# Altium schematic sheet OpenPLCv0.2.0_IOLED.SchDoc
size 420 x 297 mm; DocumentNumber: 13; SheetNumber: 13; SheetTotal: 22; SheetTitle: IO Green LED
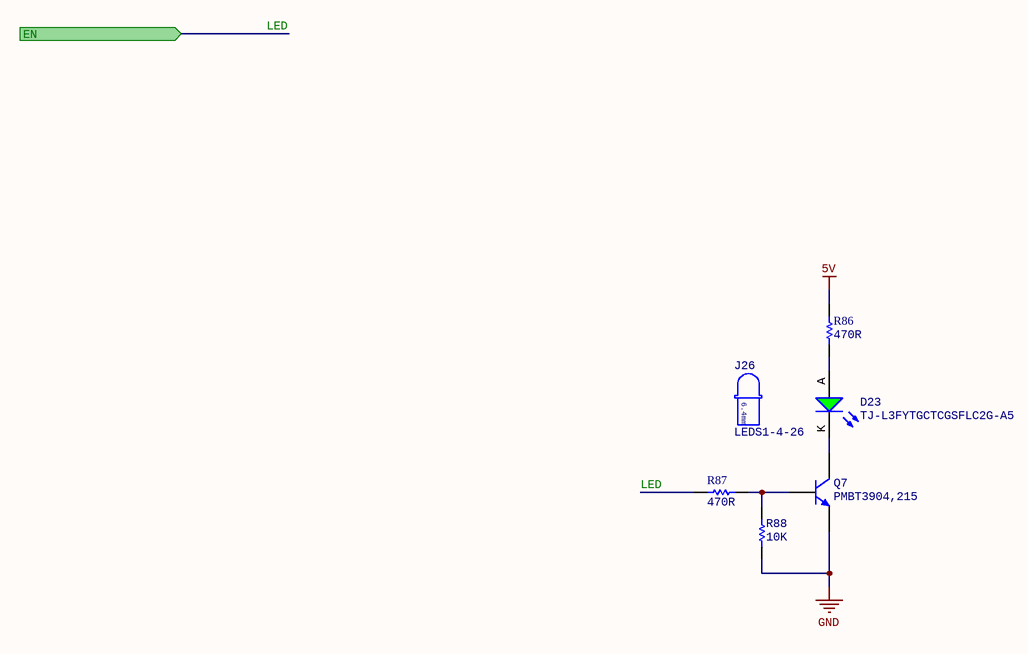
[diagram p0: OpenPLCv0.2.0_IOLED.SchDoc]

## Parts
D23  TJ-L3FYTGCTCGSFLC2G-A5  [LED_3MM_SPACED_6.4MM_GREEN]
J26  LEDS1-4-26  [3MM_LED_SPACER_6.4MM]
Q7  PMBT3904,215  [SOT23-3]
R86  Resistance: 470R  [SMD_RES_0402(1005)_N]  (hidden comment: RC0402FR-07470RL)
R87  Resistance: 470R  [SMD_RES_0402(1005)_N]  (hidden comment: RC0402FR-07470RL)
R88  Resistance: 10K  [SMD_RES_0402(1005)_N]  (hidden comment: RC0402FR-0710KL)

## Ports
EN (in)

## Nets
5V: R86.2
GND: Q7.2(E) R88.1
LED: R87.2 ; port EN
NetD23_A: D23.A R86.1
NetD23_K: D23.K Q7.3(C)
NetQ7_1: Q7.1(B) R87.1 R88.2

## Notes on the sheet
- FILE NAME
- PROJECT
- TITLE
- REV
- AUTHOR
- SIZE
- SHEET
- DATE
- OF
- A3
- (in symbol LEDS1-4-26) 6.4mm

## Library data of the parts
D23 = TJ-L3FYTGCTCGSFLC2G-A5: LED 3mm Green 515nm~530nm 1.8V~3.6V Through Hole Light Emitting Diodes (LED) RoHS C330751
J26 = LEDS1-4-26: 3mm LED spacer 6.4mm height
Q7 = PMBT3904,215: NPN 200mA 40V 250mW SOT-23(SOT-23-3) Transistors (NPN/PNP) RoHS
R86 R87 = 470R 0402 1% 1W: 470Ω ±1% 1/16W ±100ppm/℃ 0402 Chip Resistor - Surface Mount RoHS; Power Rating: 1W; Package: 0402; Tolerance: 1%
R88 = 10K 0402 1% 1/16W: 10kΩ ±1% 1/16W ±100ppm/℃ 0402 Chip Resistor - Surface Mount RoHS; Package: 0402; Tolerance: 1%; Power Rating: 1/16W